# EAGLE design Schematic-1 (EAGLE 8.2.1)
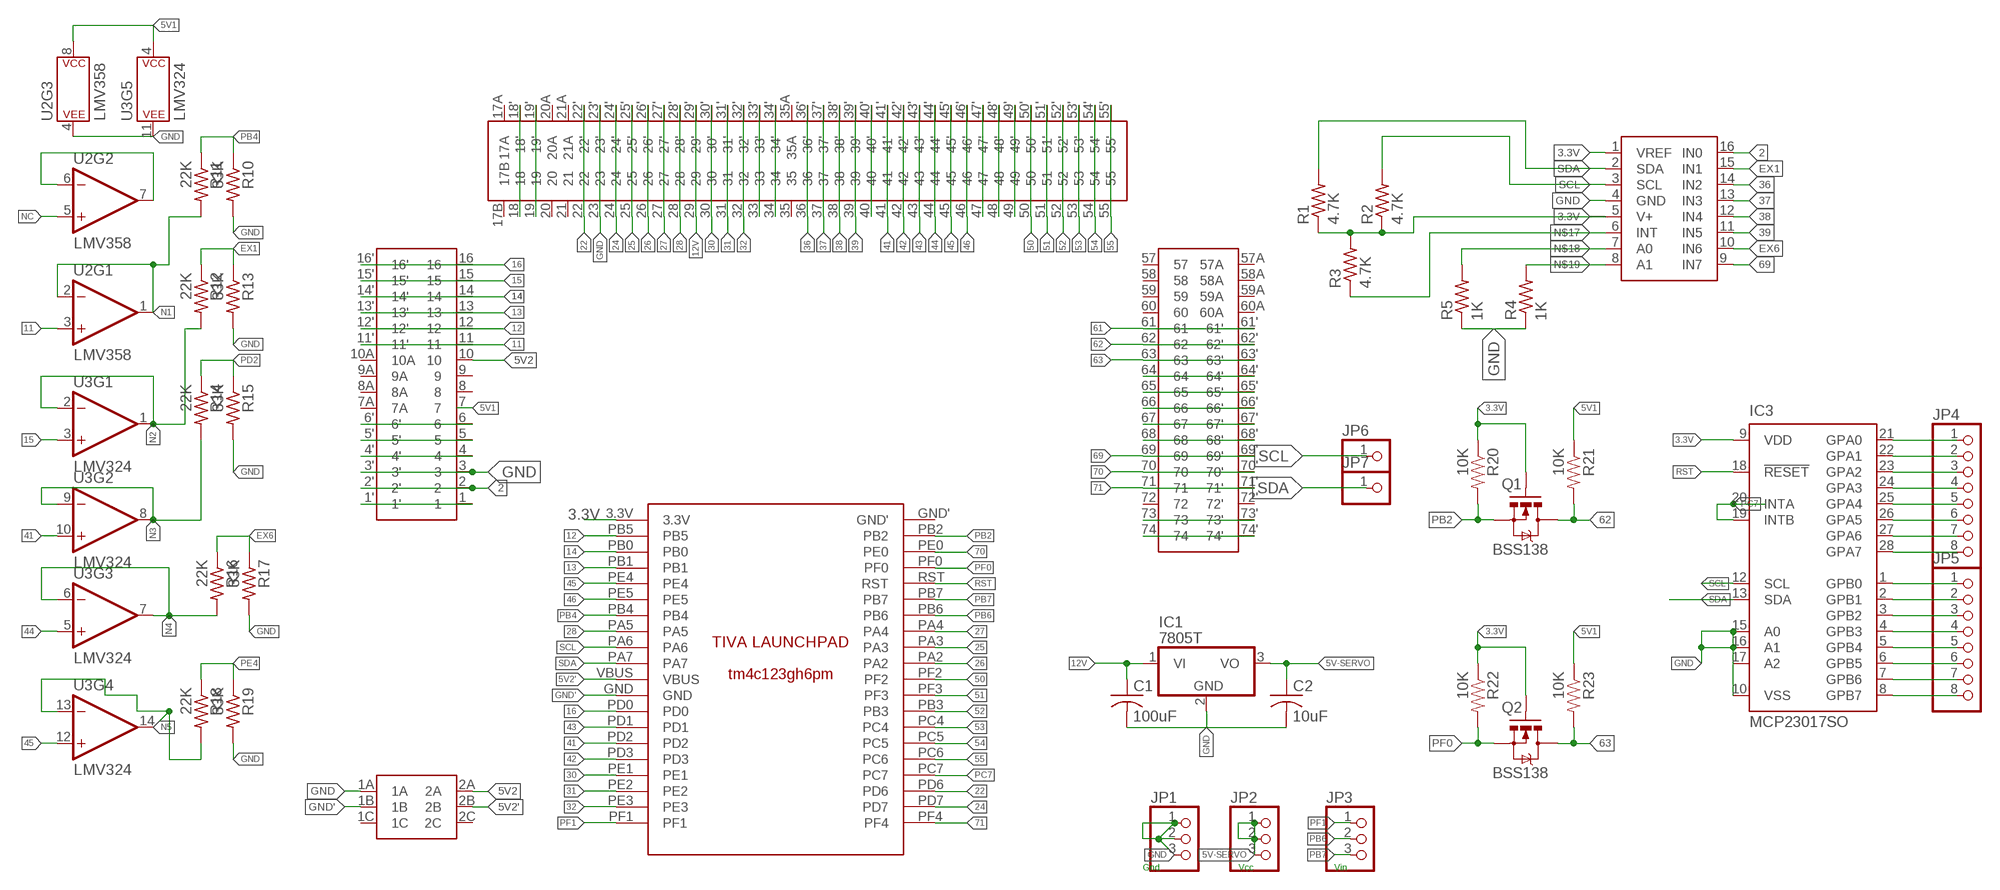
[diagram p0: schematic, sheet 1]

## Parts
C1  100uF  C-US025-030X050  [C025-030X050]
C2  10uF  C-US025-030X050  [C025-030X050]
IC1  7805T  [TO220H]
IC3  MCP23017SO  [SO28W]
JP1  PINHD-1X3  [1X03]
JP2  PINHD-1X3  [1X03]
JP3  PINHD-1X3  [1X03]
JP4  PINHD-1X8BIG  [1X08-BIG]
JP5  PINHD-1X8BIG  [1X08-BIG]
JP6  PINHD-1X1  [1X01]
JP7  PINHD-1X1  [1X01]
Q1  BSS138  MOSFET-NCHANNELSMD  [SOT23-3]
Q2  BSS138  MOSFET-NCHANNELSMD  [SOT23-3]
R1  4.7K  R-US_M1206  [M1206]
R2  4.7K  R-US_M1206  [M1206]
R3  4.7K  R-US_M1206  [M1206]
R4  1K  R-US_M1206  [M1206]
R5  1K  R-US_M1206  [M1206]
R10  33K  R-US_M1206  [M1206]
R11  22K  R-US_M1206  [M1206]
R12  22K  R-US_M1206  [M1206]
R13  33K  R-US_M1206  [M1206]
R14  22K  R-US_M1206  [M1206]
R15  33K  R-US_M1206  [M1206]
R16  22K  R-US_M1206  [M1206]
R17  33K  R-US_M1206  [M1206]
R18  22K  R-US_M1206  [M1206]
R19  33K  R-US_M1206  [M1206]
R20  10K  RESISTOR1206  [1206]
R21  10K  RESISTOR1206  [1206]
R22  10K  RESISTOR1206  [1206]
R23  10K  RESISTOR1206  [1206]
U2  LMV358  LMV358SOIC  [SO08]
U3  LMV324  [SO14]
U$1  DAUGHTERBOARDDAUGHTERBOARD  [DAUGHTERBOARD]
U$2  TIVA_LAUNCHPADTIVA_LAUNCHPAD  [TIVA_LAUNCHPAD]
U$3  SELF-LOCKING_SWITCHSELF-LOCKING_SWITCH  [SELF-LOCKING_SWITCH]
U$4  ADC128D818  [ADC12_SD]

## Nets
2: U$1.2 U$1.2' U$4.16(IN0)
3.3V [3.3V]: IC3.9(VDD) Q1.1(G) Q2.1(G) R1.1 R2.1 R3.2 R20.1 R22.1 U$2.3.3V U$4.1(VREF) U$4.5(V+)
5V1 [5V1]: R21.1 R23.1 U2.8(P$V+) U3.4(P$V+) U$1.7
5V2 [5V1]: U$1.10 U$3.2A
5V2' [5V1]: U$2.VBUS U$3.2B
5V-SERVO [5V-SERVO]: C2.1 IC1.3(VO) JP2.1 JP2.2 JP2.3
11: U2.3(+IN) U$1.11 U$1.11'
12: U$1.12 U$1.12' U$2.PB5
12V [12V]: C1.1 IC1.1(VI) U$1.29 U$1.29'
13: U$1.13 U$1.13' U$2.PB1
14: U$1.14 U$1.14' U$2.PB0
15: U3.3(+IN) U$1.15 U$1.15'
16: U$1.16 U$1.16' U$2.PD0
22: U$1.22 U$1.22' U$2.PD6
24: U$1.24 U$1.24' U$2.PD7
25: U$1.25 U$1.25' U$2.PA3
26: U$1.26 U$1.26' U$2.PA2
27: U$1.27 U$1.27' U$2.PA4
28: U$1.28 U$1.28' U$2.PA5
30: U$1.30 U$1.30' U$2.PE1
31: U$1.31 U$1.31' U$2.PE2
32: U$1.32 U$1.32' U$2.PE3
36: U$1.36 U$1.36' U$4.14(IN2)
37: U$1.37 U$1.37' U$4.13(IN3)
38: U$1.38 U$1.38' U$4.12(IN4)
39: U$1.39 U$1.39' U$4.11(IN5)
41: U3.10(+IN) U$1.41 U$1.41' U$2.PD2
42: U$1.42 U$1.42' U$2.PD3
43: U$1.43 U$1.43' U$2.PD1
44: U3.5(+IN) U$1.44 U$1.44'
45: U3.12(+IN) U$1.45 U$1.45' U$2.PE4
46: U$1.46 U$1.46' U$2.PE5
50: U$1.50 U$1.50' U$2.PF2
51: U$1.51 U$1.51' U$2.PF3
52: U$1.52 U$1.52' U$2.PB3
53: U$1.53 U$1.53' U$2.PC4
54: U$1.54 U$1.54' U$2.PC5
55: U$1.55 U$1.55' U$2.PC6
61: U$1.61 U$1.61'
62: Q1.3(D) R21.2 U$1.62 U$1.62'
63: Q2.3(D) R23.2 U$1.63 U$1.63'
69: U$1.69 U$1.69' U$4.9(IN7)
70: U$1.70 U$1.70' U$2.PE0
71: U$1.71 U$1.71' U$2.PF4
EX1: R12.1 R13.1 U$4.15(IN1)
EX6: R16.1 R17.1 U$4.10(IN6)
GND [5V1]: C1.2 C2.2 IC1.2(GND) IC3.10(VSS) IC3.15(A0) IC3.16(A1) IC3.17(A2) JP1.1 JP1.2 JP1.3 R4.1 R5.1 R10.2 R13.2 R15.2 R17.2 R19.2 U2.4(P$V-) U3.11(P$V-) U$1.3 U$1.3' U$1.23 U$1.23' U$3.1A U$4.4(GND)
GND' [5V1]: U$2.GND U$3.1B
N1: R11.2 U2.1(OUT) U2.2(-IN)
N2: R12.2 U3.1(OUT) U3.2(-IN)
N3: R14.2 U3.8(OUT) U3.9(-IN)
N4: R16.2 U3.6(-IN) U3.7(OUT)
N5: R18.2 U3.13(-IN) U3.14(OUT)
N$1: U$1.1 U$1.1'
N$2: U2.6(-IN) U2.7(OUT)
N$3: IC3.21(GPA0) JP4.1
N$4: U$1.4 U$1.4'
N$5: U$1.5 U$1.5'
N$6: U$1.6 U$1.6'
N$7: IC3.23(GPA2) JP4.3
N$8: IC3.24(GPA3) JP4.4
N$9: IC3.22(GPA1) JP4.2
N$10: IC3.25(GPA4) JP4.5
N$11: IC3.26(GPA5) JP4.6
N$12: IC3.27(GPA6) JP4.7
N$13: U$1.18 U$1.18'
N$14: U$1.19 U$1.19'
N$15: IC3.28(GPA7) JP4.8
N$17: R3.1 U$4.6(INT)
N$18: R5.2 U$4.7(A0)
N$19: R4.2 U$4.8(A1)
N$20: IC3.1(GPB0) JP5.1
N$21: IC3.2(GPB1) JP5.2
N$22: IC3.3(GPB2) JP5.3
N$23: IC3.4(GPB3) JP5.4
N$24: IC3.5(GPB4) JP5.5
N$25: IC3.6(GPB5) JP5.6
N$26: U$1.33 U$1.33'
N$27: U$1.34 U$1.34'
N$28: IC3.7(GPB6) JP5.7
N$29: IC3.8(GPB7) JP5.8
N$33: U$1.40 U$1.40'
N$39: U$1.47 U$1.47'
N$40: U$1.48 U$1.48'
N$41: U$1.49 U$1.49'
N$51: U$1.64 U$1.64'
N$52: U$1.65 U$1.65'
N$53: U$1.66 U$1.66'
N$54: U$1.67 U$1.67'
N$55: U$1.68 U$1.68'
N$59: U$1.73 U$1.73'
N$60: U$1.74 U$1.74'
NC: U2.5(+IN)
PB2: Q1.2(S) R20.2 U$2.PB2
PB4: R10.1 R11.1 U$2.PB4
PB6: JP3.2 U$2.PB6
PB7: JP3.3 U$2.PB7
PC7: IC3.19(INTB) IC3.20(INTA) U$2.PC7
PD2: R14.1 R15.1
PE4: R18.1 R19.1
PF0: Q2.2(S) R22.2 U$2.PF0
PF1: JP3.1 U$2.PF1
RST: IC3.18(!RESET) U$2.RST
SCL: IC3.12(SCL) JP6.1 R2.2 U$2.PA6 U$4.3(SCL)
SDA: IC3.13(SDA) JP7.1 R1.2 U$2.PA7 U$4.2(SDA)
Unconnected: U$1.7A U$1.8 U$1.8A U$1.9 U$1.9A U$1.10A U$1.17A U$1.17B U$1.20 U$1.20A U$1.21 U$1.21A U$1.35 U$1.35A U$1.57 U$1.57A U$1.58 U$1.58A U$1.59 U$1.59A U$1.60 U$1.60A U$1.72 U$1.72' U$2.GND' U$3.1C U$3.2C

## Notes on the sheet
- Gnd | Vcc | Vin

## Library data of the parts
C1 C2 = adafruit:C-US: CAPACITOR, American symbol
IC1 = adafruit:78*: Positive VOLTAGE REGULATOR Added bigger pads to the TO-92 package
IC3 = adafruit:MCP23017: http://ww1.microchip.com/downloads/en/DeviceDoc/21952a.pdf Source: http://ww1.microchip.com/downloads/en/DeviceDoc/21952a.pdf
JP1-JP3 = adafruit:PINHD-1X3: PIN HEADER
JP4 JP5 = adafruit:PINHD-1X8: PIN HEADER
JP6 JP7 = adafruit:PINHD-1X1: Pin header 1x1 for 0.1" spacing With round pins
Q1 Q2 = SparkFun:MOSFET-NCHANNEL
R1-R5 = rcl:R-US_: RESISTOR, American symbol
R10-R19 = adafruit:R-US_: RESISTOR, American symbol
R20-R23 = SparkFun:RESISTOR: Resistor Basic schematic elements and footprints for 0603, 1206, and PTH resistors.
U2 = SparkFun-IC-Amplifiers:LMV358: IC LMV358 DUAL OP AMP Jellybean rail-to-rail output op-amp SparkFun Products SparkFun PicoBoard <https://www.sparkfun.com/products/11888> (WIG-11888) SparkFun Vernier Interface Shield <https://www.sparkfun.com/products/12858> (DEV-12858) SparkFun Blynk Board - ESP8266 <https://www.sparkfun.com/products/13794> (WRL-13794) SparkFun Digital Sandbox <https://www.sparkfun.com/products/12651> (DEV-12651 RoHS); PROD_ID: IC-09657
U3 = SparkFun-IC-Amplifiers:LMV324: IC LMV324 Quad Op Amp Jellybean quad op-amp Datasheet <http://cdn.sparkfun.com/datasheets/Sensors/Sound/LMV324.pdf> SparkFun Products SparkFun Sensor Kit <https://www.sparkfun.com/products/13754> (DEV-13754) SparkFun Inventor's Kit for Arduino 101 <https://www.sparkfun.com/products/13844> (KIT-13844) SparkFun Sound Detector <https://www.sparkfun.com/products/12642> (SEN-12642); PROD_ID: IC-08227
U$1 = Daughterboard:DAUGHTERBOARD
U$2 = SMD_TIVA_LAUNCHPAD:TIVA_LAUNCHPAD
U$3 = Switch_Self-locking:SELF-LOCKING_SWITCH
U$4 = ADC128D818:ADC128D818

## Net classes
0 default: width 0.2 mm, clearance 0.2 mm
1 5V1: width 1 mm, clearance 0.2 mm
2 3.3V: width 1 mm, clearance 0.2 mm
3 5V-SERVO: width 1 mm, clearance 0.2 mm
4 12V: width 1 mm, clearance 0.2 mm

## Board
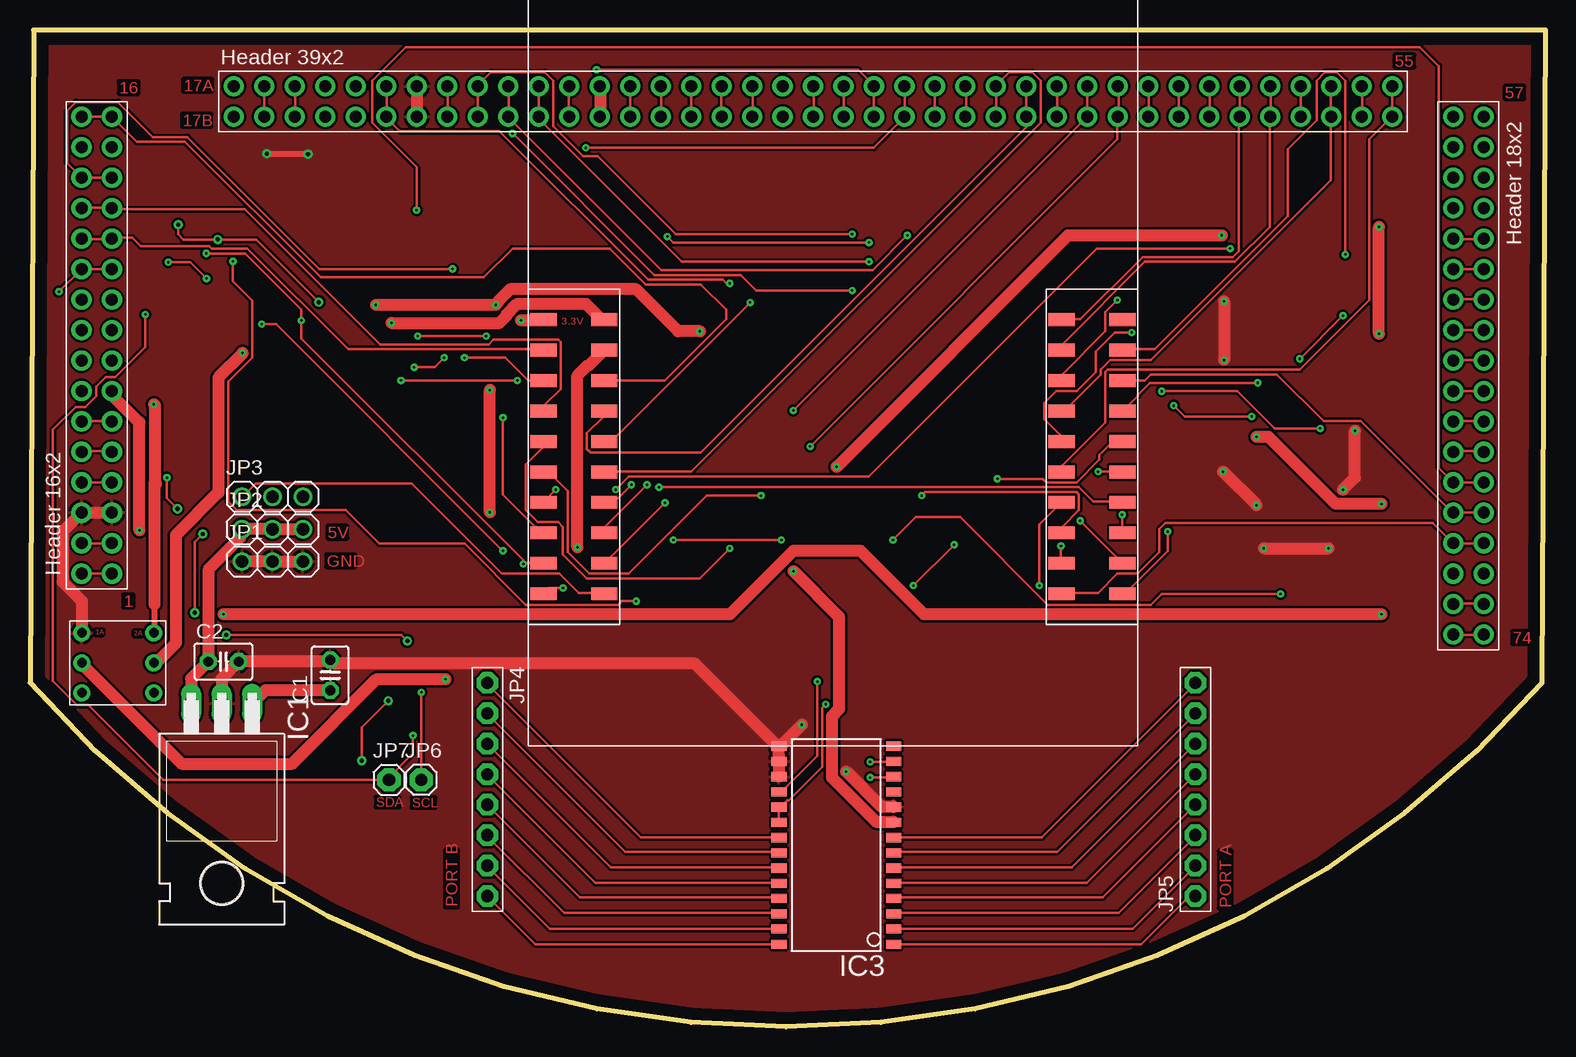
[diagram p1: board, top side]
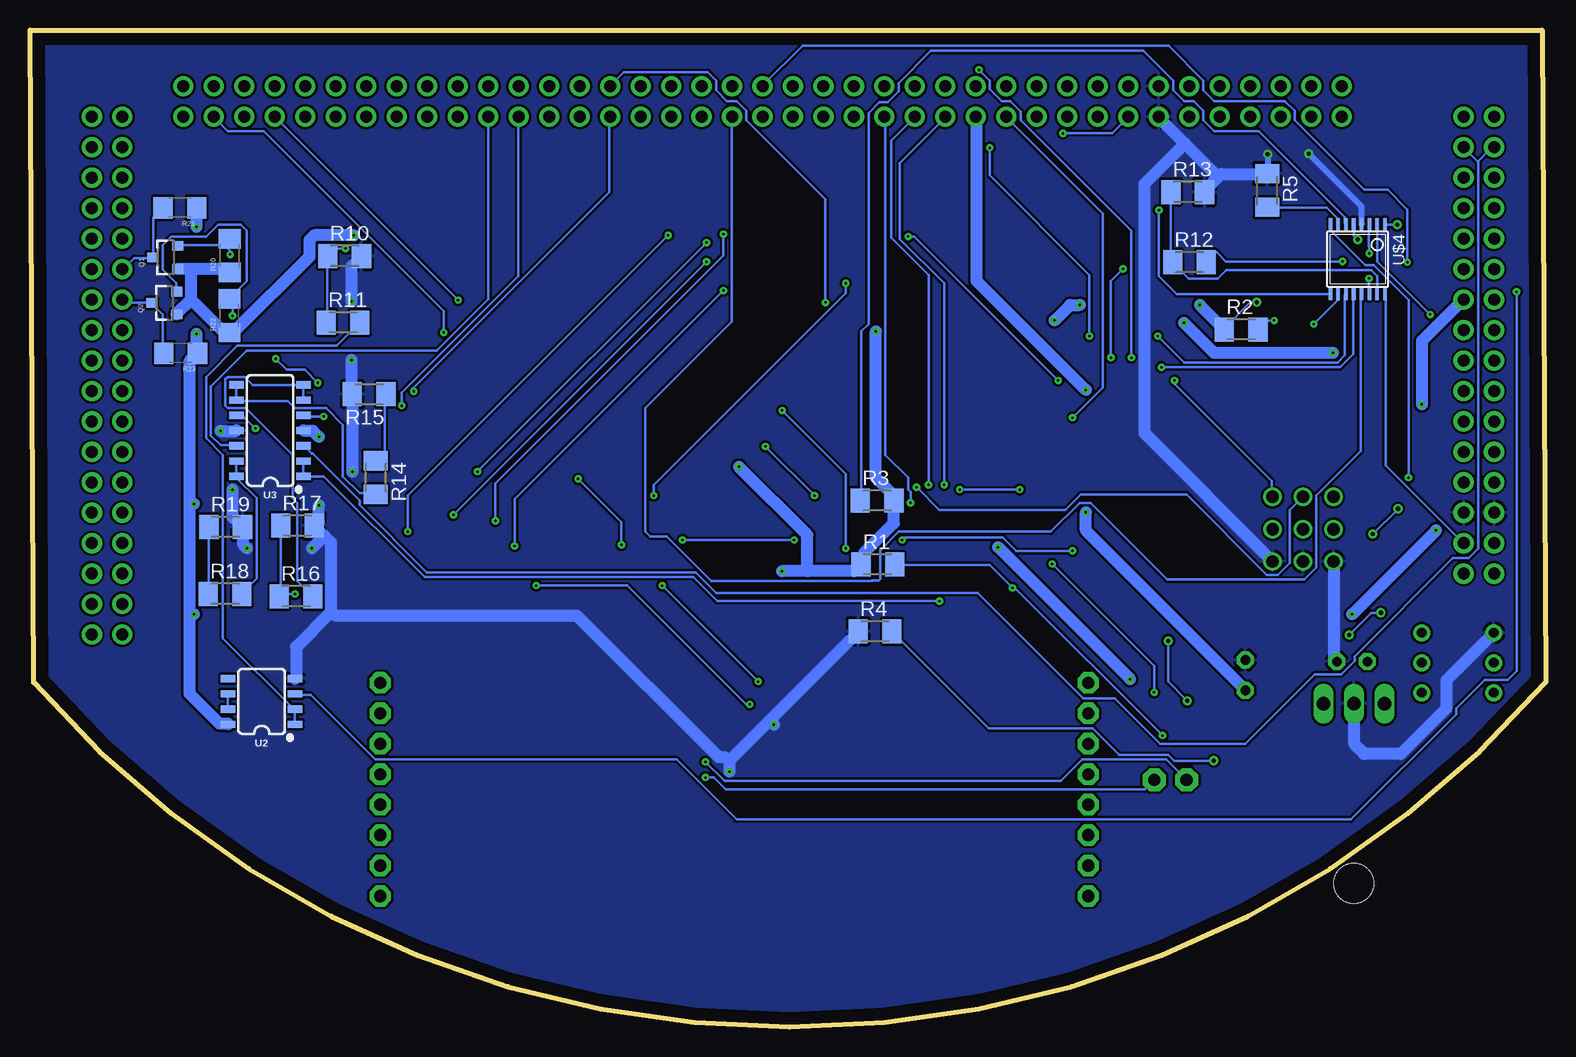
[diagram p2: board, bottom side, seen from below]

Size 126.3 x 83.12 mm. Coordinates in mm from the lower left corner, seen from the top.
Outline: 0.3,83.12 0,28.71 arc98 126,28.71 126.3,83.12 0.3,83.12
Copper layers (1*16): Top 0.035mm / dielectric 1.5mm / Bottom 0.035mm
Design rules "default *": minimum track width 6mil, minimum drill 0.2mm, track to track 6mil, track to pad 6mil, pad to pad 6mil, via to via 6mil, smd to smd 6mil, copper to edge 40mil, drill to drill 6mil, minimum pad ring 10mil, minimum via ring 8mil, stop-mask expansion 4mil, vias tented up to drill 0mil, thermal gap 10mil

### Footprints (pad centres in the part's own frame; a part is rotated, then mirrored left to right if it is on the bottom)
C025-030X050 = drill 0.813 pad 1.422 octagon: 1 -1.27,0; 2 1.27,0
TO220H = drill 1.118 long: 1 -2.54,-10.16; 2 0,-10.16; 3 2.54,-10.16 | hole 3.302: 0,4.826
SO28W = smd 0.762 x 1.27: 1 -7.62,-4.78; 2 -6.35,-4.78; 3 -5.08,-4.78; 4 -3.81,-4.78; 5 -2.54,-4.78; 6 -1.27,-4.78; 7 0,-4.78; 8 1.27,-4.78; 9 2.54,-4.78; 10 3.81,-4.78; 11 5.08,-4.78; 12 6.35,-4.78; 13 7.62,-4.78; 14 8.89,-4.78; 15 8.89,4.78; 16 7.62,4.78; 17 6.35,4.78; 18 5.08,4.78; 19 3.81,4.78; 20 2.54,4.78; 21 1.27,4.78; 22 0,4.78; 23 -1.27,4.78; 24 -2.54,4.78; 25 -3.81,4.78; 26 -5.08,4.78; 27 -6.35,4.78; 28 -7.62,4.78
1X03 = drill 1.016: 1 -2.54,0; 2 0,0; 3 2.54,0
1X08-BIG = drill 1.016 pad 1.778 octagon: 1 -8.89,0; 2 -6.35,0; 3 -3.81,0; 4 -1.27,0; 5 1.27,0; 6 3.81,0; 7 6.35,0; 8 8.89,0
1X01 = drill 1.016 pad 1.93 octagon: 1 0,0
SOT23-3 = smd 0.8 x 0.9: 1 -0.95,-1; 2 0.95,-1; 3 0,1.1
M1206 = smd 1.6 x 2: 1 -1.4,0; 2 1.4,0
1206 = smd 1.6 x 1.8: 1 -1.4,0; 2 1.4,0
SO08 = smd 0.6 x 1.2: 1 -1.905,-2.8; 2 -0.635,-2.8; 3 0.635,-2.8; 4 1.905,-2.8; 5 1.905,2.8; 6 0.635,2.8; 7 -0.635,2.8; 8 -1.905,2.8
SO14 = smd 0.6 x 1.2: 1 -3.175,-2.8; 2 -1.905,-2.8; 3 -0.635,-2.8; 4 0.635,-2.8; 5 1.905,-2.8; 6 3.175,-2.8; 7 4.445,-2.8; 8 4.445,2.8; 9 3.175,2.8; 10 1.905,2.8; 11 0.635,2.8; 12 -0.635,2.8; 13 -1.905,2.8; 14 -3.175,2.8
DAUGHTERBOARD = drill 1 pad 1.676: 1 -22.86,-22.86; 1' -25.4,-22.86; 2 -22.86,-20.32; 2' -25.4,-20.32; 3 -22.86,-17.78; 3' -25.4,-17.78; 4 -22.86,-15.24; 4' -25.4,-15.24; 5 -22.86,-12.7; 5' -25.4,-12.7; 6 -22.86,-10.16; 6' -25.4,-10.16; 7 -22.86,-7.62; 7A -25.4,-7.62; 8 -22.86,-5.08; 8A -25.4,-5.08; 9 -22.86,-2.54; 9A -25.4,-2.54; 10 -22.86,0; 10A -25.4,0; 11 -22.86,2.54; 11' -25.4,2.54; 12 -22.86,5.08; 12' -25.4,5.08; 13 -22.86,7.62; 13' -25.4,7.62; 14 -22.86,10.16; 14' -25.4,10.16; 15 -22.86,12.7; 15' -25.4,12.7; 16 -22.86,15.24; 16' -25.4,15.24; 17A -12.7,17.78; 17B -12.7,15.24; 18 -10.16,15.24; 18' -10.16,17.78; 19 -7.62,15.24; 19' -7.62,17.78; 20 -5.08,15.24; 20A -5.08,17.78; 21 -2.54,15.24; 21A -2.54,17.78; 22 0,15.24; 22' 0,17.78; 23 2.54,15.24; 23' 2.54,17.78; 24 5.08,15.24; 24' 5.08,17.78; 25 7.62,15.24; 25' 7.62,17.78; 26 10.16,15.24; 26' 10.16,17.78; 27 12.7,15.24; 27' 12.7,17.78; 28 15.24,15.24; 28' 15.24,17.78; 29 17.78,15.24; 29' 17.78,17.78; 30 20.32,15.24; 30' 20.32,17.78; 31 22.86,15.24; 31' 22.86,17.78; 32 25.4,15.24; 32' 25.4,17.78; 33 27.94,15.24; 33' 27.94,17.78; 34 30.48,15.24; 34' 30.48,17.78; 35 33.02,15.24; 35A 33.02,17.78; 36 35.56,15.24; 36' 35.56,17.78; 37 38.1,15.24; 37' 38.1,17.78; 38 40.64,15.24; 38' 40.64,17.78; 39 43.18,15.24; 39' 43.18,17.78; 40 45.72,15.24; 40' 45.72,17.78; 41 48.26,15.24; 41' 48.26,17.78; 42 50.8,15.24; 42' 50.8,17.78; 43 53.34,15.24; 43' 53.34,17.78; 44 55.88,15.24; 44' 55.88,17.78; 45 58.42,15.24; 45' 58.42,17.78; 46 60.96,15.24; 46' 60.96,17.78; 47 63.5,15.24; 47' 63.5,17.78; 48 66.04,15.24; 48' 66.04,17.78; 49 68.58,15.24; 49' 68.58,17.78; 50 71.12,15.24; 50' 71.12,17.78; 51 73.66,15.24; 51' 73.66,17.78; 52 76.2,15.24; 52' 76.2,17.78; 53 78.74,15.24; 53' 78.74,17.78; 54 81.28,15.24; 54' 81.28,17.78; 55 83.82,15.24; 55' 83.82,17.78; 57 88.9,15.24; 57A 91.44,15.24; 58 88.9,12.7; 58A 91.44,12.7; 59 88.9,10.16; 59A 91.44,10.16; 60 88.9,7.62; 60A 91.44,7.62; 61 88.9,5.08; 61' 91.44,5.08; 62 88.9,2.54; 62' 91.44,2.54; 63 88.9,0; 63' 91.44,0; 64 88.9,-2.54; 64' 91.44,-2.54; 65 88.9,-5.08; 65' 91.44,-5.08; 66 88.9,-7.62; 66' 91.44,-7.62; 67 88.9,-10.16; 67' 91.44,-10.16; 68 88.9,-12.7; 68' 91.44,-12.7; 69 88.9,-15.24; 69' 91.44,-15.24; 70 88.9,-17.78; 70' 91.44,-17.78; 71 88.9,-20.32; 71' 91.44,-20.32; 72 88.9,-22.86; 72' 91.44,-22.86; 73 88.9,-25.4; 73' 91.44,-25.4; 74 88.9,-27.94; 74' 91.44,-27.94
TIVA_LAUNCHPAD = smd 2.184 x 1.067: 3.3V -16.51,10.16; GND -11.43,7.62; GND' 31.75,10.16; PA2 31.75,-12.7; PA3 31.75,-10.16; PA4 31.75,-7.62; PA5 -16.51,-7.62; PA6 -16.51,-10.16; PA7 -16.51,-12.7; PB0 -16.51,5.08; PB1 -16.51,2.54; PB2 31.75,7.62; PB3 26.67,5.08; PB4 -16.51,-5.08; PB5 -16.51,7.62; PB6 31.75,-5.08; PB7 31.75,-2.54; PC4 26.67,2.54; PC5 26.67,0; PC6 26.67,-2.54; PC7 26.67,-5.08; PD0 -11.43,5.08; PD1 -11.43,2.54; PD2 -11.43,0; PD3 -11.43,-2.54; PD6 26.67,-7.62; PD7 26.67,-10.16; PE0 31.75,5.08; PE1 -11.43,-5.08; PE2 -11.43,-7.62; PE3 -11.43,-10.16; PE4 -16.51,0; PE5 -16.51,-2.54; PF0 31.75,2.54; PF1 -11.43,-12.7; PF2 26.67,10.16; PF3 26.67,7.62; PF4 26.67,-12.7; RST 31.75,0; VBUS -11.43,10.16
SELF-LOCKING_SWITCH = drill 0.8 pad 1.422: 1A 0,0; 1B 0,-2.5; 1C 0,-5; 2A 6,0; 2B 6,-2.5; 2C 6,-5
ADC12_SD = smd 0.305 x 0.991: 1 -2.275,-2.918; 2 -1.625,-2.918; 3 -0.975,-2.918; 4 -0.325,-2.918; 5 0.325,-2.918; 6 0.975,-2.918; 7 1.625,-2.918; 8 2.275,-2.918; 9 2.275,2.918; 10 1.625,2.918; 11 0.975,2.918; 12 0.325,2.918; 13 -0.325,2.918; 14 -0.975,2.918; 15 -1.625,2.918; 16 -2.275,2.918

### Placement (x,y rotation side)
C1  25.01,29.33 90 top
C2  16.12,30.46 0 top
IC1  15.97,16.81 180 top
IC3  67.19,14.52 90 top
JP1  20.21,38.81 0 top
JP2  20.21,41.5 0 top
JP3  20.22,44.2 0 top
JP4  38.11,19.8 270 top
JP5  97.11,19.8 90 top
JP6  32.6,20.61 0 top
JP7  29.91,20.6 0 top
Q1  114.98,64.17 90 bottom
Q2  115.07,60.36 90 bottom
R1  55.65,38.56 0 bottom
R2  25.36,58.16 0 bottom
R3  55.7,43.89 0 bottom
R4  55.88,32.98 0 bottom
R5  23.19,69.74 270 bottom
R10  100.08,64.29 0 bottom
R11  100.21,58.74 0 bottom
R12  29.68,63.76 0 bottom
R13  29.82,69.62 0 bottom
R14  97.48,45.81 270 bottom
R15  98.03,52.75 180 bottom
R16  104.12,35.91 0 bottom
R17  104.01,41.79 0 bottom
R18  110.04,36.12 0 bottom
R19  109.98,41.69 0 bottom
R20  109.65,64.31 90 bottom
R21  113.81,68.3 180 bottom
R22  109.67,59.31 90 bottom
R23  113.74,56.18 180 bottom
U2  107,27.14 90 bottom
U3  106.29,49.1 90 bottom
U$1  29.69,60.66 0 top
U$2  59.29,48.82 0 top
U$3  4.32,32.86 0 top
U$4  15.66,64.02 180 bottom

### Tracks (layer width: path | path; a pad name or v marks a point on that pad's centre or on a via)
2
  Top 0.2: U$1.2' 4.31,40.3 6.81,40.3 U$1.2
  Bottom 0.2: U$4.16 13.31,61 13.31,46.8 6.91,40.4 U$1.2
3.3V  (via drill 0.2, 0.35)
  Top 0.2: v12.36,66.9 12.36,66.08 12.78,65.66 v15.65,65.66 18.84,65.66 v24.07,60.42
  Top 1: v28.81,60.2 v38.81,60.2 39.11,60.6 40.01,61.5 50.51,61.5 54.01,58 v55.81,58 | v40.91,58.9 42.71,58.9 U$2.3.3V | v63.61,38 67.41,34.2 67.41,26.5 66.81,25.9 66.81,20.8 70.51,17.1 71.91,17.1 IC3.9 | v99.31,66 86.51,66 v67.21,46.7
  Bottom 0.2: U$4.1 13.35,66.9 v12.36,66.9 | U$4.5 15.98,65.99 v15.65,65.66 | v24.07,60.42 24.6,60.42 26.81,58.2
  Bottom 1: v28.81,60.2 26.81,58.2 R2.1 | v38.81,60.2 39.61,60.2 v40.91,58.9 | 112.91,63.2 109.91,63.2 109.71,63 R20.1 | 112.91,63.2 113.91,63.2 Q1.1 | 112.91,60.6 114.01,59.5 Q2.1 | 112.91,63.2 112.91,60.6 | 112.91,60.6 112.51,60.3 110.21,58 109.71,58 R22.1 109.21,58 103.01,64.2 103.01,65.6 102.61,66 v99.31,66 | 61.51,38 57.61,38 57.11,38.5 R1.1 56.81,39 56.81,39.5 54.31,42 54.31,43.8 R3.2 54.41,44.4 55.81,45.8 v55.81,58 | 61.51,38 v63.61,38 | v67.21,46.7 61.51,41 61.51,38
5V1  (via drill 0.2)
  Top 1: v102.21,49.2 103.21,49.2 108.81,43.6 v112.61,43.6 | v112.41,57.8 v112.41,66.7 | v9.11,41.4 9.11,50.4 6.91,52.6 6.91,53 U$1.7 | v16.11,34.4 58.31,34.4 63.61,39.7 69.21,39.7 74.51,34.4 v112.61,34.4
  Bottom 1: 113.01,43.6 113.01,55.5 112.41,56.1 R23.1 112.41,56.6 v112.41,57.8 | 113.01,43.6 113.01,34.4 | 113.01,34.4 113.01,27.8 110.51,25.3 109.81,25.3 U2.8 | v102.21,49.2 102.71,49.7 103.41,49.7 U3.4 | v112.61,43.6 113.01,43.6 | v112.41,66.7 R21.1 | v16.11,34.4 v9.11,41.4 | v112.61,34.4 113.01,34.4
5V2  (via drill 0.2)
  Top 0.508: U$3.2A 10.38,32.92 10.38,35.27
  Top 1.016: 10.51,45.28 10.4,45.39 | v10.31,51.9 10.4,51.82 10.4,45.39 | 10.4,45.39 10.38,45.36 10.38,35.27
  Bottom 1: v10.31,51.9 10.31,57.2 6.91,60.6 U$1.10
5V2'  (via drill 0.2)
  Top 1: v30.11,58.7 39.11,58.7 39.71,59.3 39.71,59.4 40.61,60.3 46.31,60.3 47.61,59 47.81,59 U$2.VBUS
  Top 1.016: v17.71,56.2 17.71,56.15 15.71,54.14 15.71,44.56 12.17,41.02 12.17,32.03 10.71,30.58 10.54,30.58 U$3.2B
  Bottom 1: v30.11,58.7 27.61,56.2 v17.71,56.2
5V-SERVO
  Top 1: JP2.3 22.71,41.5 20.61,41.5 JP2.2 20.11,41.5 17.71,41.5 JP2.1 17.51,41 17.51,40.8 14.91,38.2 14.91,30.9 C2.1 14.91,30.4
  Top 1.016: C2.1 13.43,29.05 IC1.3
11  (via drill 0.2)
  Top 0.2: v2.41,61.3 4.21,63.1 U$1.11' 4.31,63.2 6.81,63.2 U$1.11
  Bottom 0.2: U2.3 104.11,27.7 102.91,27.7 97.51,22.3 72.41,22.3 67.41,17.3 16.21,17.3 7.44,26.08 7.44,26.58 5.07,28.95 3.14,28.95 2.41,29.67 v2.41,61.3
12
  Top 0.2: U$2.PB5 42.71,56.5 26.51,56.5 18.1,64.91 15.13,64.91 14.94,65.1 9.24,65.1 8.54,65.8 6.91,65.8 U$1.12 6.81,65.7 4.31,65.7 U$1.12'
12V  (via drill 0.2)
  Top 1: U$1.29 47.51,75.9 47.51,78.4 U$1.29' | 24.91,28 C1.1 | v38.31,42.9 v38.31,53.1
  Top 1.016: C1.1 19.61,28.06 IC1.1
  Bottom 1: v38.31,53.1 47.41,62.2 47.41,75.8 U$1.29 | v38.31,42.9 38.31,41.4 25.01,28.1 C1.1
13
  Top 0.2: U$2.PB1 42.81,51.4 42.81,51.8 44.21,53.2 44.21,57.1 44.01,57.3 38.61,57.3 38.21,56.9 29.18,56.9 17.88,68.2 6.91,68.2 U$1.13 6.81,68.3 4.31,68.3 U$1.13'
14  (via drill 0.2)
  Top 0.2: v36.21,55.8 39.61,55.8 41.51,53.9 42.71,53.9 U$2.PB0 | v35.21,63.2 24.11,63.2 13.11,74.2 10.21,74.2 7.31,77.1 3.81,77.1 3.11,76.4 3.11,72 4.21,70.9 U$1.14' 4.31,70.8 6.81,70.8 U$1.14
  Bottom 0.2: v36.21,55.8 36.21,62.2 v35.21,63.2
15
  Bottom 0.2: 5.66,72.15 6.81,73.3 U$1.15 | 5.66,72.15 5.61,72.1 5.61,39.9 6.41,39.1 7.71,39.1 15.91,30.9 15.91,30.5 17.01,29.4 19.21,29.4 25.01,23.6 32.11,23.6 35.91,27.4 38.51,27.4 47.31,36.2 69.11,36.2 70.81,37.9 93.21,37.9 98.81,43.5 98.81,43.9 102.71,47.8 102.81,47.8 103.41,48.4 U3.3 | 5.66,72.15 4.51,73.3 4.31,73.3 U$1.15'
16
  Top 0.2: U$2.PD0 47.91,53.9 52.91,53.9 58.01,59 58.01,59.8 55.91,61.9 51.31,61.9 48.31,64.9 40.21,64.9 37.81,62.5 24.21,62.5 12.91,73.8 8.91,73.8 6.91,75.8 U$1.16 6.81,75.9 4.31,75.9 U$1.16'
22  (via drill 0.2)
  Top 0.2: v74.31,44.3 74.61,44.6 87.21,44.6 87.41,44.4 87.41,43.1 86.01,41.7 86.01,41.2 U$2.PD6 | v58.31,62 58.01,62 57.71,62.3 51.51,62.3 39.11,74.7 30.81,74.7 29.71,75.8 U$1.22 29.71,75.9 29.71,78.4 U$1.22'
  Bottom 0.2: v74.31,44.3 74.31,45.2 58.31,61.2 v58.31,62
24  (via drill 0.2)
  Top 0.2: v85.91,40.1 85.91,38.7 U$2.PD7 | v68.51,61.4 60.51,61.4 59.21,62.7 52.01,62.7 v40.21,74.5 | U$1.24' 34.81,78.4 34.81,75.9 U$1.24
  Bottom 0.2: v85.91,40.1 85.91,44 v68.51,61.4 | v40.21,74.5 36.11,74.5 34.81,75.8 U$1.24
25  (via drill 0.2)
  Top 0.2: v87.51,42.2 91.01,38.7 U$2.PA3 | v68.51,66.1 53.81,66.1 47.31,72.6 46.11,72.6 43.61,75.1 43.61,78.9 42.91,79.6 38.41,79.6 37.31,78.5 U$1.25' 37.31,78.4 U$1.25
  Bottom 0.2: v87.51,42.2 87.51,45.3 68.51,64.3 v68.51,66.1
26  (via drill 0.2)
  Top 0.2: v94.81,41.3 94.81,39.7 91.31,36.2 91.11,36.2 U$2.PA2 | v73.11,66 70.21,63.1 52.61,63.1 39.91,75.8 U$1.26 39.91,75.9 39.91,78.4 U$1.26'
  Bottom 0.2: v94.81,41.3 94.81,44.3 v73.11,66
27  (via drill 0.2)
  Top 0.2: v91.01,42.7 91.01,41.2 U$2.PA4 | v69.91,63.8 54.31,63.8 42.31,75.8 U$1.27 42.41,75.9 42.41,78.4 U$1.27'
  Bottom 0.2: v69.91,63.8 v91.01,42.7
28  (via drill 0.2)
  Top 0.2: v39.41,50.8 39.41,44.4 42.11,41.7 42.21,41.7 42.71,41.2 U$2.PA5 | U$1.28' 44.91,78.4 44.91,75.9 U$1.28
  Bottom 0.2: v39.41,50.8 36.91,53.3 36.91,67.8 44.91,75.8 U$1.28
30  (via drill 0.2)
  Top 0.2: v50.11,45.2 48.71,43.8 47.91,43.8 U$2.PE1 | U$1.30' 50.01,78.4 U$1.30
  Bottom 0.2: v50.11,45.2 50.11,62 53.81,65.7 53.81,72 50.01,75.8 U$1.30
31  (via drill 0.2)
  Top 0.2: v51.41,45.2 47.91,41.7 47.91,41.2 U$2.PE2 | U$1.31' 52.61,78.4 52.61,75.9 U$1.31
  Bottom 0.2: v51.41,45.2 51.41,62.7 54.51,65.8 54.51,73.9 52.61,75.8 U$1.31
32  (via drill 0.2)
  Top 0.2: v52.91,43.7 47.91,38.7 U$2.PE3 | U$1.32' 55.11,78.4 55.11,75.9 U$1.32
  Bottom 0.2: v52.91,43.7 52.91,44.6 53.11,44.8 53.11,45.8 55.01,47.7 55.01,75.8 U$1.32
36  (via drill 0.2)
  Top 0.2: U$1.36 65.31,75.9 65.31,78.4 U$1.36' | v11.52,63.76 13.35,63.76 v14.71,62.4
  Bottom 0.2: v14.71,62.4 14.71,61.1 U$4.14 | U$1.36' 65.21,78.5 61.91,81.8 31.41,81.8 28.51,78.9 28.51,78.1 27.61,77.2 21.71,77.2 20.91,76.4 20.91,75.6 15.1,69.79 13.17,69.79 11.52,68.15 v11.52,63.76
37
  Top 0.2: U$1.37' 67.81,78.4 67.81,75.9 U$1.37
  Bottom 0.2: U$4.13 15.41,61 15.41,48 19.11,44.3 19.11,38.3 20.11,37.3 31.51,37.3 37.91,43.7 38.81,43.7 41.21,41.3 53.88,41.3 55.46,39.73 55.46,37.64 55.45,37.64 55.45,37.34 55.58,37.21 56.11,37.21 56.11,37.2 69.51,37.2 73.21,40.9 74.61,40.9 75.01,41.3 75.01,51.6 67.81,58.8 67.81,75.8 U$1.37
38  (via drill 0.2)
  Top 0.2: v32.01,55 33.71,55 v34.51,55.8 | v47.21,79.8 69.01,79.8 70.31,78.5 U$1.38' 70.31,78.4 70.31,75.9 U$1.38
  Bottom 0.2: v32.01,55 17.11,55 16.01,56.1 16.01,61 U$4.12 | v34.51,55.8 34.51,66.4 43.71,75.6 43.71,76.3 44.61,77.2 45.31,77.2 46.31,78.2 46.31,78.9 v47.21,79.8
39  (via drill 0.2)
  Top 0.2: v38.01,57.6 v32.31,57.6 | v46.31,73.3 70.31,73.3 72.81,75.8 U$1.39 72.91,75.9 72.91,78.4 U$1.39'
  Bottom 0.2: v32.31,57.6 30.11,55.4 17.31,55.4 16.71,56 16.71,61 U$4.11 | v38.01,57.6 38.01,62.7 46.31,71 v46.31,73.3
41  (via drill 0.2)
  Top 0.2: v107.51,49.9 103.71,49.9 100.61,53 v94.31,53 | v60.01,60.4 48.51,48.9 47.91,48.9 U$2.PD2 | U$1.41 78.01,75.9 78.01,78.4 U$1.41'
  Bottom 0.2: v107.51,49.9 108.51,50.9 109.01,50.9 U3.10 | v94.31,53 94.31,53.3 78.01,69.6 78.01,75.8 U$1.41 | v60.01,60.4 60.01,69 66.61,75.6 66.61,76.4 67.41,77.2 68.21,77.2 69.11,78.1 69.11,78.9 69.81,79.6 76.81,79.6 77.91,78.5 U$1.41'
42
  Top 0.2: U$2.PD3 47.91,46.3 55.11,46.3 84.21,75.4 84.21,78.9 83.51,79.6 81.61,79.6 80.51,78.5 U$1.42' 80.51,78.4 80.51,75.9 U$1.42
43
  Top 0.2: U$2.PD1 47.81,51.3 47.81,50.9 46.41,49.5 46.41,48.2 46.71,47.9 55.91,47.9 83.01,75 83.01,75.8 U$1.43 83.01,75.9 83.01,78.4 U$1.43'
44  (via drill 0.2)
  Top 0.2: v101.81,50.9 96.21,50.9 v95.31,51.8 | U$1.44' 85.61,78.4 85.61,75.9 U$1.44
  Bottom 0.2: v101.81,50.9 103.41,50.9 U3.5 | v95.31,51.8 95.31,52.9 85.61,62.6 85.61,75.8 U$1.44
45  (via drill 0.2)
  Top 0.2: v58.31,39.9 55.81,37.4 46.41,37.4 44.41,39.4 44.41,41.7 44.01,42.1 42.31,42.1 41.31,43.1 41.31,46.9 42.71,48.3 42.71,48.8 U$2.PE4 | v63.61,51.4 88.01,75.8 U$1.45 88.11,78.4 U$1.45'
  Bottom 0.2: U3.12 109.11,48.5 110.41,48.5 111.21,49.3 111.21,53.4 108.21,56.4 92.41,56.4 88.11,60.7 88.11,75.8 U$1.45 | v58.31,39.9 58.31,46.1 v63.61,51.4
46  (via drill 0.2)
  Top 0.2: v60.91,44.3 56.41,44.3 49.91,37.8 46.61,37.8 44.81,39.6 44.81,44.7 43.31,46.2 42.81,46.2 U$2.PE5 | v65.01,48.4 90.61,74 90.61,75.8 U$1.46 90.71,75.9 90.71,78.4 U$1.46'
  Bottom 0.2: v65.01,48.4 v60.91,44.3
50
  Top 0.2: U$2.PF2 86.01,59 87.51,59 92.71,64.2 100.21,64.2 100.71,64.7 100.71,75.8 U$1.50 100.81,78.4 U$1.50'
51
  Top 0.2: U$2.PF3 86.01,56.5 86.01,56.9 92.91,63.8 100.41,63.8 103.31,66.7 103.31,75.8 U$1.51 103.41,75.9 103.41,78.4 U$1.51'
52  (via drill 0.2)
  Top 0.2: v90.61,60.6 89.61,59.6 89.61,58 86.01,54.4 86.01,53.9 U$2.PB3 | U$1.52' 105.91,78.4 105.91,75.9 U$1.52
  Bottom 0.2: v90.61,60.6 105.81,75.8 U$1.52
53
  Top 0.2: U$2.PC4 86.01,51.4 86.21,51.4 89.21,54.4 89.21,54.8 90.01,55.6 93.41,55.6 108.41,70.6 108.41,75.8 U$1.53 108.41,75.9 108.41,78.4 U$1.53'
54  (via drill 0.2)
  Top 0.2: v91.81,57.9 90.41,57.9 88.81,56.3 88.81,54.6 87.21,53 85.51,53 84.51,52 84.51,50.7 85.91,49.3 85.91,48.9 U$2.PC5 | U$1.54' 111.01,78.4 111.01,75.9 U$1.54
  Bottom 0.2: v91.81,57.9 91.81,59.7 106.81,74.7 109.81,74.7 110.91,75.8 U$1.54
55
  Top 0.2: U$2.PC6 86.01,46.3 86.01,46.8 89.61,50.4 89.61,54.6 89.81,54.8 105.81,54.8 111.61,60.6 111.61,74 113.41,75.8 U$1.55 113.51,78.4 U$1.55'
61
  Top 0.2: U$1.61 118.61,65.7 121.11,65.7 U$1.61'
62
  Top 0.2: U$1.62' 121.11,63.2 118.61,63.2 U$1.62
  Bottom 0.2: U$1.62 118.51,63.2 117.61,64.1 116.11,64.1 Q1.3 116.01,64.2 116.01,67.5 R21.2
63
  Top 0.2: U$1.63' 121.11,60.7 118.61,60.7 U$1.63
  Bottom 0.2: U$1.63 118.51,60.6 118.31,60.4 116.21,60.4 Q2.3 116.11,60.3 115.21,59.4 115.21,56.2 R23.2
69  (via drill 0.2)
  Top 0.2: v32.21,68.1 32.21,71.7 28.51,75.4 28.51,78.9 31.31,81.7 115.81,81.7 117.41,80.1 117.41,46.6 118.51,45.5 U$1.69 118.61,45.4 121.11,45.4 U$1.69'
  Bottom 0.2: v32.21,68.1 32.21,62.6 30.71,61.1 18.01,61.1 U$4.9
70
  Top 0.2: U$2.PE0 91.11,53.9 92.91,53.9 93.41,54.4 103.91,54.4 107.81,50.5 110.91,50.5 118.51,42.9 U$1.70 118.61,42.9 121.11,42.9 U$1.70'
71
  Top 0.2: U$2.PF4 86.01,36.2 89.01,36.2 90.61,37.8 92.31,37.8 94.11,39.6 94.11,41.5 94.61,42 116.91,42 118.51,40.4 U$1.71 118.61,40.3 121.11,40.3 U$1.71'
EX1
  Bottom 0.2: U$4.15 14.01,61.1 14.01,62.6 14.51,63.1 26.61,63.1 27.31,62.4 29.71,62.4 31.01,63.7 R12.1 31.11,63.8 31.21,63.9 31.21,69.6 R13.1
EX6  (via drill 0.2)
  Top 0.2: v19.31,58.6 20.51,58.6 v39.41,39.7 | v62.61,40.6 v53.61,40.6 | v71.91,40.6 73.81,42.5 77.51,42.5 84.81,35.2 93.41,35.2 94.31,36.1 v104.21,36.1
  Bottom 0.2: v19.31,58.6 17.31,60.6 17.31,61 U$4.10 | v39.41,39.7 44.11,39.7 45.21,40.8 53.41,40.8 v53.61,40.6 | v71.91,40.6 v62.61,40.6 | 105.41,36.1 v104.21,36.1 | 105.41,36.1 105.51,36 R16.1 105.41,36.1 | 105.41,36.1 105.41,41.7 R17.1
GND  (via drill 0.2, 0.35)
  Top 0.508: v19.72,72.8 23.13,72.8 v23.17,72.76
  Top 1: U$1.23 32.21,75.9 32.21,78.4 U$1.23' | 4.31,35.5 2.71,37.1 2.71,41.3 4.21,42.8 U$1.3' 4.71,42.9 6.81,42.9 U$1.3 | JP1.1 17.71,38.8 20.11,38.8 JP1.2 20.61,38.8 22.71,38.8 JP1.3 | 17.41,30.4 C2.2 17.91,30.5 24.91,30.5 C1.2 25.41,30.3 55.41,30.3 62.01,23.7 IC3.15 | IC3.17 62.41,20.9 62.41,22.1 IC3.16 62.41,22.6 IC3.15 | v68.01,21.3 70.91,18.4 71.91,18.4 IC3.10 | v64.31,25.2 62.81,23.7 IC3.15 | v99.51,60.5 v99.51,55.6 | v110.41,49.7 110.41,45.8 v109.41,44.8 | v102.81,39.9 v108.21,39.9 | v102.21,43.5 v99.41,46.3
  Top 1.016: C2.2 15.97,29.05 IC1.2 | 4.31,35.5 U$3.1A
  Bottom 0.508: U$4.4 15.33,68.41 v19.72,72.8 | v23.17,72.76 23.17,71.17 R5.1
  Bottom 1: 27.26,70.85 28.41,69.7 R13.2 | 27.26,70.85 27.01,71.1 23.21,71.1 R5.1 | 27.26,70.85 30.06,73.65 | 30.06,73.65 32.21,75.8 U$1.23 | JP1.1 17.61,38.8 17.61,30.7 17.41,30.5 C2.2 | 30.06,73.65 33.41,70.3 33.41,49.5 22.81,38.9 JP1.3 | 68.01,22.2 v68.01,21.3 | 64.66,25.55 57.31,32.9 R4.1 | 64.66,25.55 68.01,22.2 | v64.31,25.2 64.66,25.55 | v99.51,55.6 99.51,52.8 R15.2 99.41,52.3 v99.41,46.3 | v99.51,60.5 99.51,63.4 98.71,64.2 R10.2 | v110.41,49.7 109.11,49.7 U3.11 | v109.41,44.8 109.41,42.5 108.61,41.7 R19.2 108.51,41.2 108.51,40.2 v108.21,39.9 | 101.21,34.6 104.11,31.7 104.11,29.1 U2.4 | 101.21,34.6 101.21,40.4 101.76,40.95 | 101.76,40.95 102.51,41.7 R17.2 102.21,42.1 v102.21,43.5 | 101.76,40.95 v102.81,39.9 | 68.01,22.2 68.41,22.5 68.91,22.5 80.71,34.3 100.81,34.3 101.21,34.6
  Bottom 1.016: IC1.2 15.93,26.93 15.93,23.58 15.12,22.77 12.08,22.77 8.25,26.6 8.25,28.93 U$3.1A
  pour Top: -9.89,98.8 -9.89,-1.2 130.11,-1.2 130.11,98.8
  pour Bottom: -19.89,108.8 -19.89,-11.2 140.11,-11.2 140.11,108.8
GND'  (via drill 0.2)
  Top 1: v45.61,40 45.61,54.3 46.41,55.1 46.51,55.1 47.81,56.4 U$2.GND | 28.91,29 v34.61,29
  Top 1.016: U$3.1B 4.32,30.27 12.64,21.96 21.87,21.96 28.91,29
  Bottom 1: v34.61,29 v45.61,40
N1
  Bottom 0.2: U2.1 104.21,25.3 U2.2 104.31,26.5 110.21,32.4 110.21,47.7 111.61,49.1 111.61,54.2 109.01,56.8 100.71,56.8 98.81,58.7 R11.2
N2  (via drill 0.2)
  Top 0.2: v50.51,35.5 49.31,35.5 49.01,35.2 41.31,35.2 36.21,40.3 29.11,40.3 26.31,43.1 17.21,43.1 16.51,43.8 16.51,53.8 18.52,55.82 18.52,60.57 16.91,62.18 v16.91,63.83
  Bottom 0.2: U3.2 103.51,47.1 103.51,46 U3.1 103.41,45.9 101.81,45.9 93.41,37.5 71.01,37.5 69.01,35.5 v50.51,35.5 | R12.2 28.21,63.8 27.41,64.6 26.64,63.83 v16.91,63.83
N3
  Bottom 0.2: U3.8 109.11,53.5 109.11,52.3 U3.9 109.01,52.2 104.81,52.2 104.21,51.6 101.61,51.6 100.21,50.2 100.21,45.9 98.81,44.5 97.51,44.5 R14.2
N4
  Bottom 0.2: U3.6 103.51,52.3 103.51,53.5 U3.7 103.61,53.5 107.71,53.5 108.41,54.2 109.81,54.2 110.01,54 110.01,51.8 109.81,51.6 108.31,51.6 104.41,47.7 104.41,44.3 104.51,44.2 104.01,43.71 104.01,37.2 102.81,36 R16.2
N5
  Bottom 0.2: U3.13 109.11,47.1 109.11,46 U3.14 109.01,45.9 109.01,45.7 107.41,44.1 107.41,37.4 108.61,36.2 R18.2
N$1
  Top 0.2: U$1.1' 4.31,37.8 6.81,37.8 U$1.1
N$2
  Bottom 0.2: U2.7 109.81,26.6 109.81,27.7 U2.6
N$3
  Top 0.2: IC3.21 62.31,15.8 50.91,15.8 38.11,28.6 JP4.1
N$4
  Top 0.2: U$1.4' 4.31,45.4 6.81,45.4 U$1.4
N$5
  Top 0.2: U$1.5' 4.31,48 6.81,48 U$1.5
N$6
  Top 0.2: U$1.6' 4.31,50.5 6.81,50.5 U$1.6
N$7
  Top 0.2: IC3.23 62.31,13.3 48.41,13.3 JP4.3
N$8
  Top 0.2: IC3.24 62.31,12 47.11,12 38.11,21 JP4.4
N$9
  Top 0.2: IC3.22 62.31,14.6 49.61,14.6 38.11,26.1 JP4.2
N$10
  Top 0.2: IC3.25 62.31,10.8 45.81,10.8 38.11,18.5 JP4.5
N$11
  Top 0.2: IC3.26 62.31,9.5 44.51,9.5 38.11,15.9 JP4.6
N$12
  Top 0.2: IC3.27 62.31,8.2 43.31,8.2 38.11,13.4 JP4.7
N$13
  Top 0.2: U$1.18 19.51,75.9 19.51,78.4 U$1.18'
N$14
  Top 0.2: U$1.19 22.11,75.9 22.11,78.4 U$1.19'
N$15
  Top 0.2: IC3.28 42.11,6.9 JP4.8
N$17
  Bottom 0.2: U$4.6 16.71,67 16.71,67.5 23.91,74.7 27.61,74.7 28.51,75.6 28.51,76.4 29.31,77.2 30.11,77.2 31.01,78.1 31.01,78.9 33.51,81.4 51.21,81.4 53.91,78.7 53.91,78 54.81,77.1 55.51,77.1 56.41,76.2 56.41,58.6 57.01,58 57.01,43.9 R3.1
N$18
  Bottom 0.2: U$4.7 17.31,67 17.31,67.4 18.21,68.3 23.11,68.3 R5.2
N$19  (via drill 0.2, 0.35)
  Top 0.2: v27.64,22.21 27.64,24.99 v29.85,27.2 | v31.45,32.19 30.95,32.7 v16.36,32.7 | v11.41,45.8 11.41,44.09 v12.29,43.21 | v14.4,41.1 13.72,40.42 v13.72,34.54
  Bottom 0.2: v11.41,45.8 11.41,60.6 14.31,63.5 15.01,63.5 17.91,66.4 17.91,66.9 U$4.8 | R4.2 54.41,32.9 46.41,24.9 37.71,24.9 35.51,22.7 31.45,22.7 30.95,22.21 v27.64,22.21 | v29.85,27.2 31.45,28.8 v31.45,32.19 | v16.36,32.7 14.52,34.54 v13.72,34.54 | v12.29,43.21 v12.29,43.2 v14.4,41.1
N$20
  Top 0.2: IC3.1 92.61,6.9 96.61,10.9 JP5.1
N$21
  Top 0.2: IC3.2 72.01,8.2 91.91,8.2 97.11,13.4 JP5.2
N$22
  Top 0.2: IC3.3 72.01,9.5 90.71,9.5 97.11,15.9 JP5.3
N$23
  Top 0.2: 97.11,18.5 96.31,18.5 | IC3.4 72.01,10.8 89.41,10.8 97.11,18.5 | 97.11,18.5 JP5.4
N$24
  Top 0.2: IC3.5 72.01,12 88.04,12 JP5.5 97.11,21
N$25
  Top 0.2: IC3.6 72.01,13.3 86.81,13.3 JP5.6
N$26
  Top 0.2: U$1.33 57.61,75.9 57.61,78.4 U$1.33'
N$27
  Top 0.2: U$1.34 60.21,75.9 60.21,78.4 U$1.34'
N$28
  Top 0.2: IC3.7 72.01,14.6 85.61,14.6 97.11,26.1 JP5.7
N$29
  Top 0.2: IC3.8 72.01,15.8 84.31,15.8 97.11,28.6 JP5.8
N$33
  Top 0.2: U$1.40 75.41,78.4 U$1.40'
N$39
  Top 0.2: U$1.47 93.21,75.9 93.21,78.4 U$1.47'
N$40
  Top 0.2: U$1.48 95.71,75.9 95.71,78.4 U$1.48'
N$41
  Top 0.2: U$1.49 98.31,75.9 98.31,78.4 U$1.49'
N$51
  Top 0.2: U$1.64 118.61,58.1 121.11,58.1 U$1.64'
N$52
  Top 0.2: U$1.65 118.61,55.6 121.11,55.6 U$1.65'
N$53
  Top 0.2: U$1.66 118.61,53 121.11,53 U$1.66'
N$54
  Top 0.2: U$1.67 118.61,50.5 121.11,50.5 U$1.67'
N$55
  Top 0.2: U$1.68 118.61,48 121.11,48 U$1.68'
N$59
  Top 0.2: U$1.73 118.61,35.3 121.11,35.3 U$1.73'
N$60
  Top 0.2: U$1.74 118.61,32.7 121.11,32.7 U$1.74'
PB2  (via drill 0.2)
  Top 0.2: v109.61,64.4 109.61,78.9 108.91,79.6 107.91,79.6 107.21,78.9 107.21,75.6 104.81,73.2 104.81,67.6 93.71,56.5 91.11,56.5 U$2.PB2
  Bottom 0.2: Q1.2 113.91,65.2 110.21,65.2 109.71,65.7 R20.2 110.11,65.2 109.61,64.7 v109.61,64.4
PB4  (via drill 0.2)
  Top 0.2: v43.81,44.8 42.81,43.8 U$2.PB4 | v48.81,44.8 49.91,45.9 69.91,45.9 88.91,64.9 v100.01,64.9
  Bottom 0.2: R11.1 101.51,58.8 101.51,64.2 R10.1 101.41,64.3 100.81,64.9 v100.01,64.9 | v48.81,44.8 v43.81,44.8
PB6  (via drill 0.2)
  Top 0.2: v52.41,45 87.41,45 88.61,43.8 91.01,43.8 U$2.PB6
  Bottom 0.2: v52.41,45 50.51,43.1 40.01,43.1 38.71,44.4 29.91,44.4 23.21,37.7 22.31,37.7 21.31,38.7 21.31,43.1 20.31,44.1 JP3.2
PB7  (via drill 0.2)
  Top 0.2: v89.01,46.3 91.01,46.3 U$2.PB7 | v69.91,65.4 53.61,65.4 v53.11,65.9 | v30.91,53.9 v40.61,53.9
  Bottom 0.2: v69.91,65.4 v89.01,46.3 | v53.11,65.9 52.61,65.9 v40.61,53.9 | v30.91,53.9 30.91,53.6 22.81,45.5 22.81,44.2 JP3.3
PC7  (via drill 0.2)
  Top 0.2: IC3.20 62.41,17.1 62.41,18.3 IC3.19 62.51,18.3 63.11,18.9 63.21,18.9 66.01,21.7 66.01,26.6 v66.31,26.9 | v84.11,36.8 84.11,41.9 85.91,43.7 U$2.PC7
  Bottom 0.2: v66.31,26.9 66.61,26.9 76.51,36.8 v84.11,36.8
PD2
  Bottom 0.2: R15.1 96.71,52.7 96.71,48 97.41,47.3 R14.1
PE4
  Bottom 0.2: R19.1 111.41,41.6 111.41,36.2 R18.1
PF0  (via drill 0.2)
  Top 0.2: v102.31,53.7 93.31,53.7 92.31,52.7 92.31,52.6 91.11,51.4 U$2.PF0 | v109.41,59.3 v105.81,55.7
  Bottom 0.2: Q2.2 114.11,61.4 114.11,62.01 115.24,63.14 115.24,65.18 114.51,65.9 111.61,65.9 110.61,66.9 108.71,66.9 108.21,66.4 108.21,62.2 109.61,60.8 R22.2 109.61,60.7 109.41,60.5 v109.41,59.3 | v102.31,53.7 103.41,54.8 104.91,54.8 v105.81,55.7
PF1
  Top 0.2: U$2.PF1 47.81,36.2 45.71,36.2 44.11,37.8 39.31,37.8 31.81,45.3 18.81,45.3 17.71,44.2 JP3.1
RST  (via drill 0.2)
  Top 0.2: IC3.18 62.61,19.6 65.61,22.6 v65.61,28.8 | v77.01,40.2 v73.61,36.8 | v80.61,45.7 84.41,45.7 84.71,45.4 87.21,45.4 89.11,47.3 89.11,47.7 90.21,48.8 91.01,48.8 U$2.RST
  Bottom 0.2: v73.61,36.8 v65.61,28.8 | v77.01,40.2 77.01,42.1 v80.61,45.7
SCL  (via drill 0.2)
  Top 0.2: v70.01,20.8 71.91,20.8 IC3.12 | 41.26,38.75 22.61,57.4 v22.61,58.9 22.61,59.8 17.92,64.5 v14.69,64.5 | 41.26,38.75 41.31,38.7 42.71,38.7 U$2.PA6 | v32.61,27.9 32.61,20.7 JP6.1 | 41.26,38.75 v41.11,38.6
  Bottom 0.2: v70.01,20.8 69.31,20.8 68.31,19.8 33.41,19.8 JP6.1 | v14.69,64.5 14.71,65.6 14.71,66.9 U$4.3 | v22.61,58.9 23.21,58.9 23.91,58.2 R2.2 | v32.61,27.9 32.61,30.1 v41.11,38.6
SDA  (via drill 0.2)
  Top 0.2: v44.41,36.6 43.21,36.6 42.81,36.2 U$2.PA7 | v9.61,59.4 9.61,56.7 7.11,54.2 6.31,54.2 5.51,53.4 5.51,52.6 4.61,51.7 3.81,51.7 1.91,49.8 1.91,28.84 3.9,26.85 4.85,26.85 11.09,20.6 29.81,20.6 JP7.1 29.81,20.7 31.91,22.8 v31.91,24.3 | v70.01,22.1 71.91,22.1 IC3.13
  Bottom 0.2: R1.2 54.21,38.5 46.31,38.5 v44.41,36.6 44.21,36.6 v31.91,24.3 | v9.61,59.4 14.01,63.8 14.01,66.9 U$4.2 | v70.01,22.1 68.41,20.5 40.41,20.5 38.61,22.3 31.61,22.3 JP7.1

### Text on the board
Top: 55 | 16 | 17A | 57 | 17B | 3.3V | 5V | GND | 1 | 1A | 2A | 74 | SDA | SCL | PORT B | PORT A